# Altium schematic sheet Sheet1.SchDoc
size A
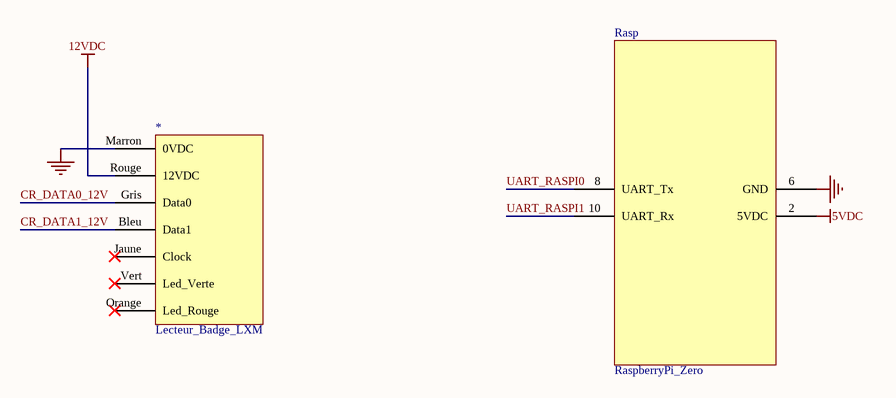
[diagram p0: Sheet1.SchDoc]

## Parts
*  Lecteur_Badge_LXM
Rasp  RaspberryPi_Zero

## Nets
5VDC: Rasp.2(5VDC)
12VDC: *.Rouge(12VDC)
GND: *.Marron(0VDC) Rasp.6(GND)
CR_DATA0_12V: *.Gris(Data0)
CR_DATA1_12V: *.Bleu(Data1)
UART_RASPI0: Rasp.8(UART_Tx)
UART_RASPI1: Rasp.10(UART_Rx)

Not connected (* = marked no-connect by the designer): * Jaune(Clock)* Orange(Led_Rouge)* Vert(Led_Verte)*

## Library data of the parts
* = Lecteur_Badge_LXM: Fournisseur: Gregoire; Fabricant: Stid-Security; Ref.Fournisseur: :); Ref.Fabricant: LXM_WIEGAND44b